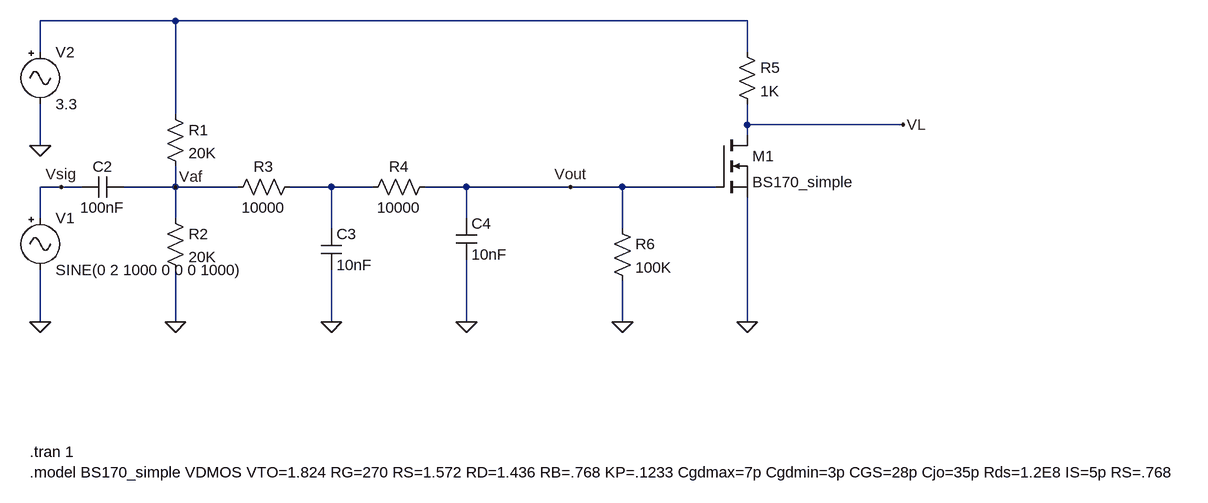
[diagram p0: schematic PixiePico_LTSpice_AFFilter.asc]
PixiePico_LTSpice_AFFilter.asc, the LTspice schematic file:
Version 4
SHEET 1 2644 1892
WIRE 112 -64 -96 -64
WIRE 992 -64 112 -64
WIRE -96 -16 -96 -64
WIRE 992 -16 992 -64
WIRE 112 80 112 -64
WIRE 992 96 992 64
WIRE 1232 96 992 96
WIRE 992 112 992 96
WIRE -96 128 -96 64
WIRE -64 192 -96 192
WIRE -32 192 -64 192
WIRE 112 192 112 160
WIRE 112 192 32 192
WIRE 208 192 112 192
WIRE 352 192 288 192
WIRE 416 192 352 192
WIRE 560 192 496 192
WIRE 720 192 560 192
WIRE 800 192 720 192
WIRE 944 192 800 192
WIRE -96 240 -96 192
WIRE 112 240 112 192
WIRE 560 240 560 192
WIRE 352 256 352 192
WIRE 800 256 800 192
WIRE -96 400 -96 320
WIRE 112 400 112 320
WIRE 352 400 352 320
WIRE 560 400 560 304
WIRE 800 400 800 336
WIRE 992 400 992 208
FLAG -96 400 0
FLAG 112 400 0
FLAG 352 400 0
FLAG 560 400 0
FLAG 800 400 0
FLAG -64 192 Vsig
FLAG 112 192 Vaf
FLAG 720 192 Vout
FLAG -96 128 0
FLAG 1232 96 VL
FLAG 992 400 0
SYMBOL cap 32 176 R90
WINDOW 0 0 32 VBottom 2
WINDOW 3 32 32 VTop 2
SYMATTR InstName C2
SYMATTR Value 100nF
SYMBOL Res 96 64 R0
SYMATTR InstName R1
SYMATTR Value 20K
SYMBOL Res 96 224 R0
SYMATTR InstName R2
SYMATTR Value 20K
SYMBOL Res 304 176 R90
WINDOW 0 0 56 VBottom 2
WINDOW 3 32 56 VTop 2
SYMATTR InstName R3
SYMATTR Value 10000
SYMBOL Res 512 176 R90
WINDOW 0 0 56 VBottom 2
WINDOW 3 32 56 VTop 2
SYMATTR InstName R4
SYMATTR Value 10000
SYMBOL cap 336 256 R0
SYMATTR InstName C3
SYMATTR Value 10nF
SYMBOL cap 544 240 R0
SYMATTR InstName C4
SYMATTR Value 10nF
SYMBOL Misc/signal -96 224 R0
SYMATTR InstName V1
SYMATTR Value SINE(0 2 1000 0 0 0 1000)
SYMATTR Value2 AC 1
SYMBOL res 784 240 R0
SYMATTR InstName R6
SYMATTR Value 100K
SYMBOL Misc/signal -96 -32 R0
SYMATTR InstName V2
SYMATTR Value 3.3
SYMATTR Value2 AC 3.3
SYMBOL Res 976 -32 R0
SYMATTR InstName R5
SYMATTR Value 1K
SYMBOL nmos 944 112 R0
SYMATTR InstName M1
SYMATTR Value BS170_simple
TEXT -112 600 Left 2 !.tran 1\n.model BS170_simple VDMOS VTO=1.824 RG=270 RS=1.572 RD=1.436 RB=.768 KP=.1233 Cgdmax=7p Cgdmin=3p CGS=28p Cjo=35p Rds=1.2E8 IS=5p RS=.768

The netlist it stands for:
* PixiePico_LTSpice_AFFilter.asc
C2 Vaf Vsig 100nF
R1 N001 Vaf 20K
R2 Vaf 0 20K
R3 N002 Vaf 10000
R4 Vout N002 10000
C3 N002 0 10nF
C4 Vout 0 10nF
V1 Vsig 0 SINE(0 2 1000 0 0 0 1000) AC 1
R6 Vout 0 100K
V2 N001 0 3.3 AC 3.3
R5 N001 VL 1K
M1 VL Vout 0 0 BS170_simple
.model NMOS NMOS
.model PMOS PMOS
.lib standard.mos
.tran 1
.model BS170_simple VDMOS VTO=1.824 RG=270 RS=1.572 RD=1.436 RB=.768 KP=.1233 Cgdmax=7p Cgdmin=3p CGS=28p Cjo=35p Rds=1.2E8 IS=5p RS=.768
.backanno
.end